# EAGLE design PowerSensor (EAGLE 8.2.1)
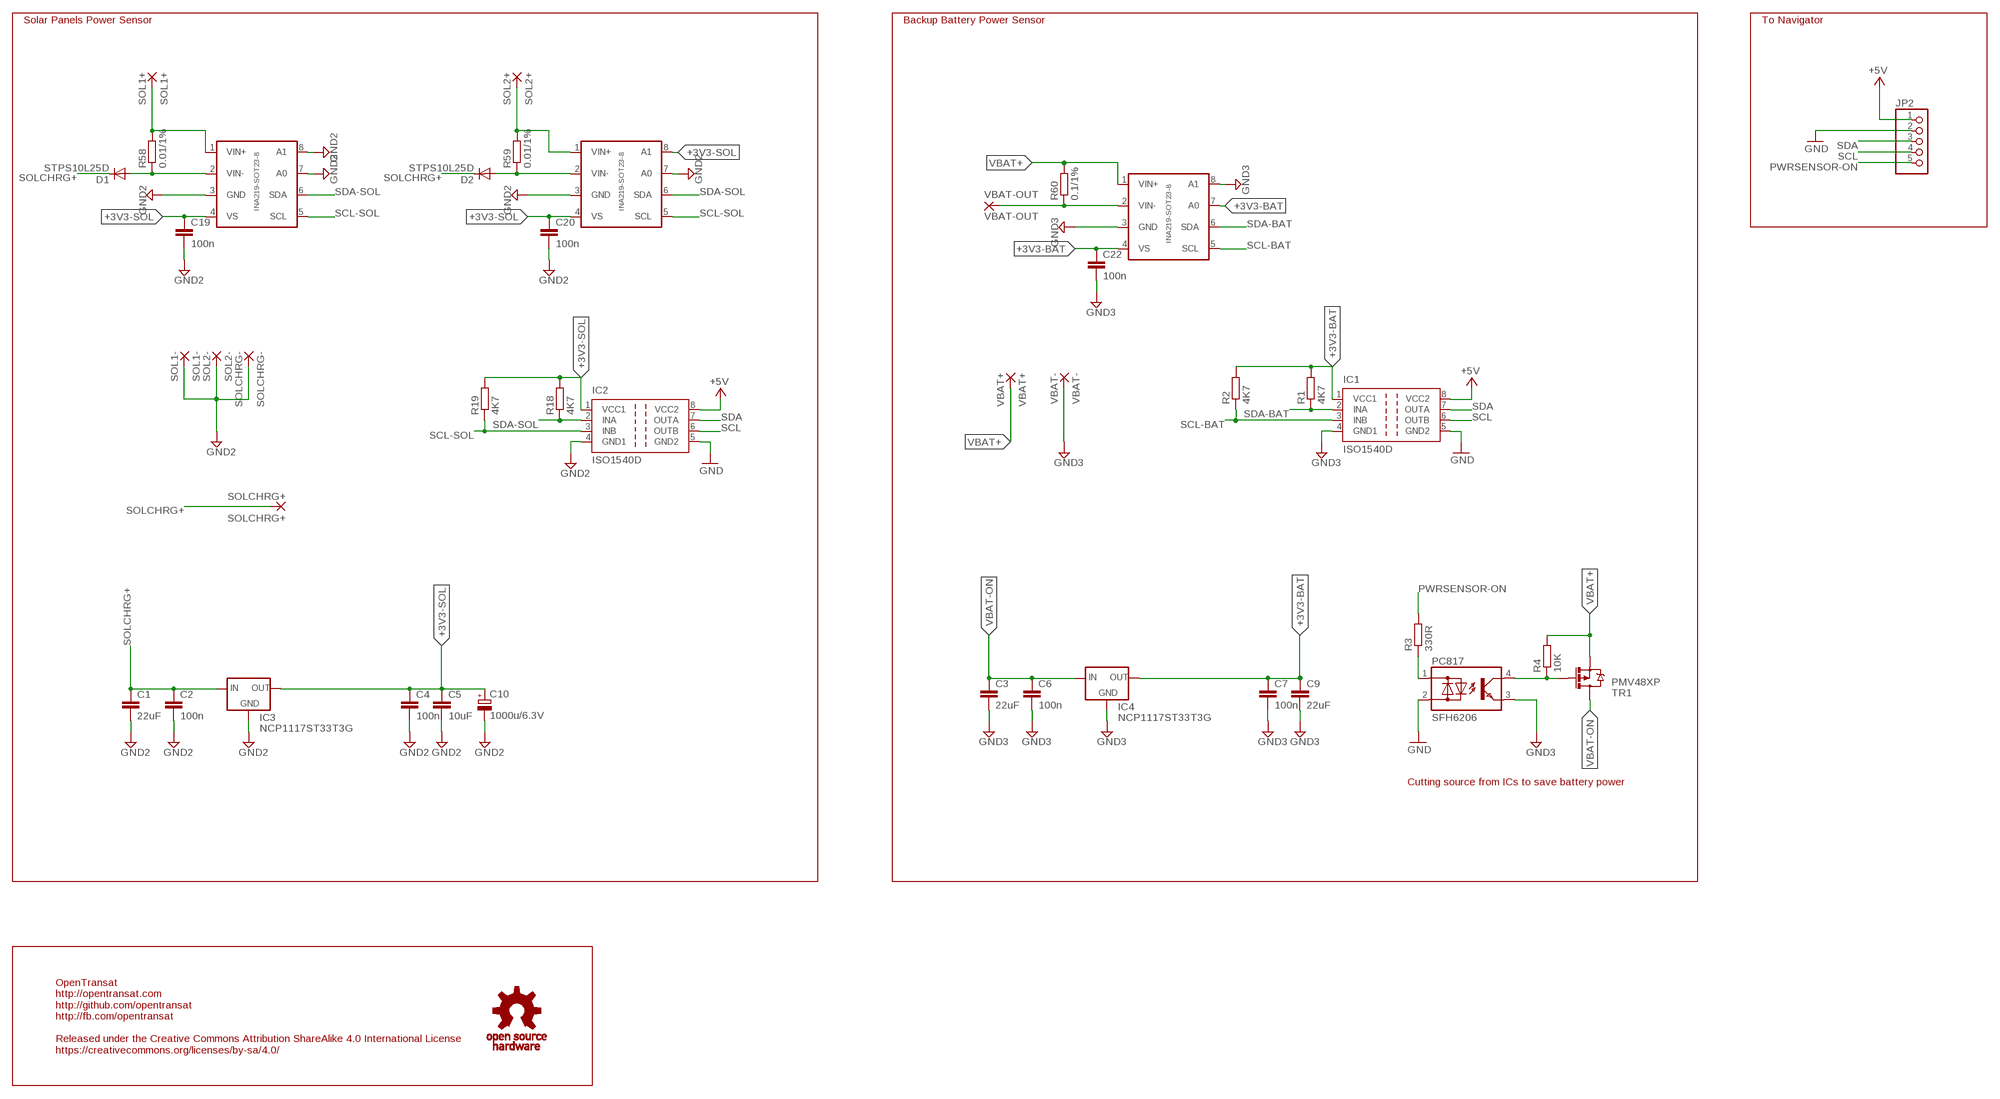
[diagram p0: schematic, sheet 1]

## Parts
C1  22uF  C-EUC1210  [C1210]
C2  100n  C-EUC0603  [C0603]
C3  22uF  C-EUC1210  [C1210]
C4  100n  C-EUC0603  [C0603]
C5  10uF  C-EUC1206  [C1206]
C6  100n  C-EUC0603  [C0603]
C7  100n  C-EUC0603  [C0603]
C9  22uF  C-EUC1210  [C1210]
C10  1000u/6.3V  CPOL-EUE3.5-8  [E3,5-8]
C19  100n  C-EUC0603  [C0603]
C20  100n  C-EUC0603  [C0603]
C22  100n  C-EUC0603  [C0603]
D1  STPS10L25D  DIODE-TO220V  [TO220ACS]
D2  STPS10L25D  DIODE-TO220V  [TO220ACS]
IC1  ISO1540D  ISO7220A  [SO-08]
IC2  ISO1540D  ISO7220A  [SO-08]
IC3  NCP1117ST33T3G  LM1117MP-3.3  [SOT223]
IC4  NCP1117ST33T3G  LM1117MP-3.3  [SOT223]
JP2  PINHD-1X5  [1X05]
PC817  SFH6206  [DIL4-SMD]
R1  4K7  R-EU_R0603  [R0603]
R2  4K7  R-EU_R0603  [R0603]
R3  330R  R-EU_R0603  [R0603]
R4  10K  R-EU_R0603  [R0603]
R18  4K7  R-EU_R0603  [R0603]
R19  4K7  R-EU_R0603  [R0603]
R58  0.01/1%  R-EU_R2512  [R2512]
R59  0.01/1%  R-EU_R2512  [R2512]
R60  0.1/1%  R-EU_R2512  [R2512]
SOL1+  SOL1+  SMD10  [SMD5,08-10,16]
SOL1-  SOL1-  SMD10  [SMD5,08-10,16]
SOL2+  SOL2+  SMD10  [SMD5,08-10,16]
SOL2-  SOL2-  SMD10  [SMD5,08-10,16]
SOLCHRG+  SOLCHRG+  SMD10  [SMD5,08-10,16]
SOLCHRG-  SOLCHRG-  SMD10  [SMD5,08-10,16]
TR1  PMV48XP  MOSFET-PCHANNEL_SOT23-3  [SOT23-3]
U$1  INA219-SOT23-8  [SOT23-8]
U$2  OSHW  [OSHWM]
U$4  INA219-SOT23-8  [SOT23-8]
U$5  INA219-SOT23-8  [SOT23-8]
VBAT+  VBAT+  WIREPADSMD2,54-5,08  [SMD2,54-5,08]
VBAT-  VBAT-  WIREPADSMD2,54-5,08  [SMD2,54-5,08]
VBAT-OUT  VBAT-OUT  WIREPADSMD2,54-5,08  [SMD2,54-5,08]

## Nets
+3V3-BAT: C7.1 C9.1 C22.1 IC1.1(VCC1) IC4.2(OUT) IC4.4(OUT) R1.2 R2.2 U$5.4(VS) U$5.7(A0)
+3V3-SOL: C4.1 C5.1 C10.+ C19.1 C20.1 IC2.1(VCC1) IC3.2(OUT) IC3.4(OUT) R18.2 R19.2 U$1.4(VS) U$4.4(VS) U$4.8(A1)
+5V: IC1.8(VCC2) IC2.8(VCC2) JP2.1
GND: IC1.5(GND2) IC2.5(GND2) JP2.2 PC817.2(AC2)
GND2: C1.2 C2.2 C4.2 C5.2 C10.- C19.2 C20.2 IC2.4(GND1) IC3.1(GND) SOL1-.1(P) SOL2-.1(P) SOLCHRG-.1(P) U$1.3(GND) U$1.7(A0) U$1.8(A1) U$4.3(GND) U$4.7(A0)
GND3: C3.2 C6.2 C7.2 C9.2 C22.2 IC1.4(GND1) IC4.1(GND) PC817.3(E) U$5.3(GND) U$5.8(A1) VBAT-.1(P)
N$1: D1.A R58.1 U$1.2(VIN-)
N$2: D2.A R59.1 U$4.2(VIN-)
N$3: R58.2 SOL1+.1(P) U$1.1(VIN+)
N$4: R59.2 SOL2+.1(P) U$4.1(VIN+)
N$6: R60.1 U$5.2(VIN-) VBAT-OUT.1(P)
N$7: PC817.1(AC1) R3.1
N$8: PC817.4(C) R4.1 TR1.1(G)
PWRSENSOR-ON: JP2.5 R3.2
SCL: IC1.6(OUTB) IC2.6(OUTB) JP2.4
SCL-BAT: IC1.3(INB) R2.1 U$5.5(SCL)
SCL-SOL: IC2.3(INB) R19.1 U$1.5(SCL) U$4.5(SCL)
SDA: IC1.7(OUTA) IC2.7(OUTA) JP2.3
SDA-BAT: IC1.2(INA) R1.1 U$5.6(SDA)
SDA-SOL: IC2.2(INA) R18.1 U$1.6(SDA) U$4.6(SDA)
SOLCHRG+: C1.1 C2.1 D1.C D2.C IC3.3(IN) SOLCHRG+.1(P)
VBAT+: R4.2 R60.2 TR1.2(S) U$5.1(VIN+) VBAT+.1(P)
VBAT-ON: C3.1 C6.1 IC4.3(IN) TR1.3(D)

## Notes on the sheet
- Solar Panels Power Sensor | Backup Battery Power Sensor | To Navigator
- Cutting source from ICs to save battery power
- OpenTransat
  http://opentransat.com
  http://github.com/opentransat
  http://fb.com/opentransat
  
  Released under the Creative Commons Attribution ShareAlike 4.0 International License
  https://creativecommons.org/licenses/by-sa/4.0/

## Library data of the parts
C1-C7 C9 C19 C20 C22 = rcl:C-EU: CAPACITOR, European symbol
C10 = rcl:CPOL-EU: POLARIZED CAPACITOR, European symbol
D1 D2 = diode:DIODE-: DIODE
IC1 IC2 = texas:ISO7220: DUAL DIGITAL ISOLATORS Source: http://focus.ti.com/lit/ds/symlink/iso7221a.pdf; MPN: ISO7220AD; OC_FARNELL: 1390649; OC_NEWARK: 48M0666
IC3 IC4 = lm1117_10:LM1117?-*: 800mA Low-Dropout Linear Regulator Source: http://www.ti.com/lit/ds/symlink/lm1117-n.pdf; MF: Texas Instruments; MPN: LM1117MP-3.3; OC_FARNELL: 9778195; OC_NEWARK: 28X3416
JP2 = pinhead:PINHD-1X5: PIN HEADER
PC817 = optocoupler:SFH620: Optocoupler, Phototransistor Output, AC Input Source: http://www.vishay.com/docs/83675/sfh620.pdf; MF: VISHAY/TELEFUNKEN; MPN: SFH6206-3; OC_FARNELL: 1469585; OC_NEWARK: 58K2214
R1-R4 R18 R19 R58-R60 = rcl:R-EU_: RESISTOR, European symbol
SOL1+ SOL1- SOL2+ SOL2- SOLCHRG+ SOLCHRG- = wirepad:SMD10: SMD PAD
TR1 = Simplex-DiscreteSemi:MOSFET-PCHANNEL: Generic P-channel mosfet
U$1 U$4 U$5 = INA219:INA219-SOT23-8: INA219 Bi-Directional CURRENT/POWER MONITOR with I2C™ Interface http://www.ti.com/lit/ds/symlink/ina219.pdf
U$2 = oshw:OSHW
VBAT+ VBAT- VBAT-OUT = wirepad:WIREPAD: Wire PAD connect wire on PCB

## Net classes
3 GND: width 0.305 mm, drill 0.508 mm, clearance 0.203 mm

## Board
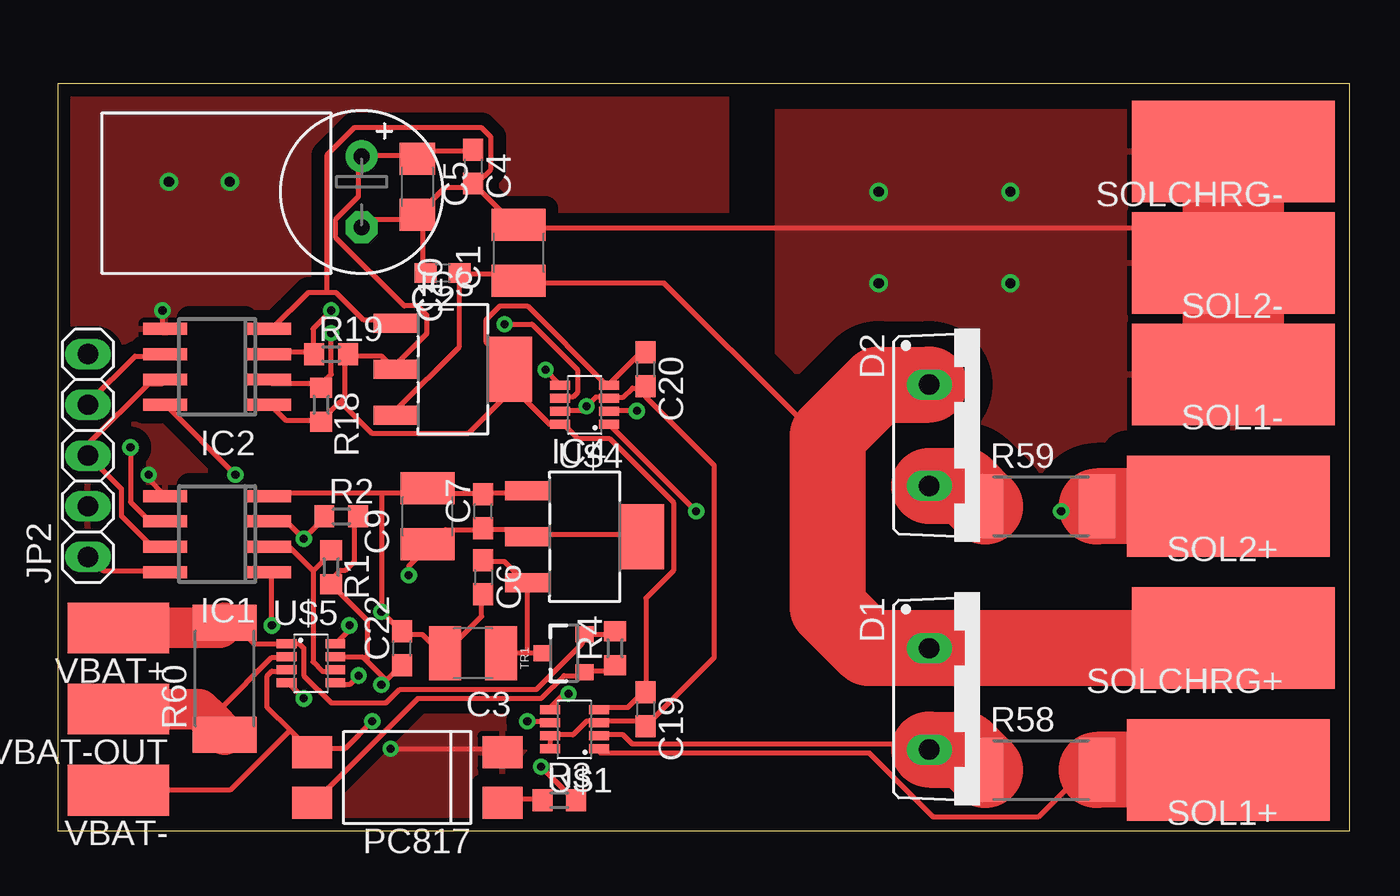
[diagram p1: board, top side]
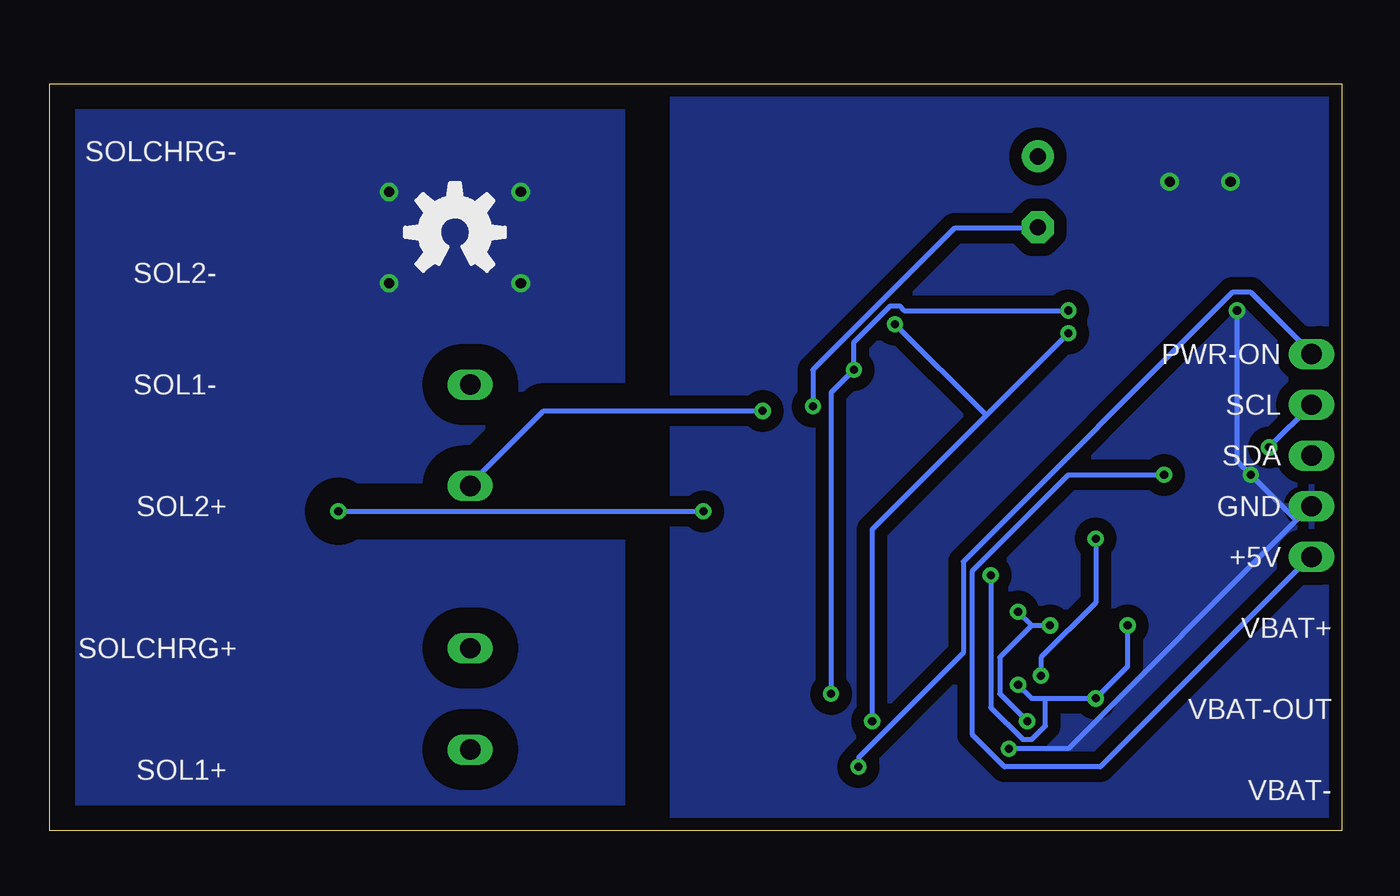
[diagram p2: board, bottom side, seen from below]

Size 64.75 x 37.43 mm. Coordinates in mm from the lower left corner, seen from the top.
Outline: 0,0 64.75,0 64.75,37.43 0,37.43 0,0
Copper layers (1*16): Top 0.035mm / dielectric 0.5mm / Bottom 0.035mm
Design rules "autorouter *": minimum track width 10mil, minimum drill 16mil, track to track 8mil, track to pad 8mil, pad to pad 8mil, via to via 8mil, smd to smd 8mil, copper to edge 15mil, drill to drill 12mil, minimum pad ring 10mil, minimum via ring 8mil, stop-mask expansion 1mil, vias tented up to drill 30mil, thermal gap 10mil

### Footprints (pad centres in the part's own frame; a part is rotated, then mirrored left to right if it is on the bottom)
C1210 = smd 1.6 x 2.7: 1 -1.4,0; 2 1.4,0
C0603 = smd 1.1 x 1: 1 -0.85,0; 2 0.85,0
C1206 = smd 1.6 x 1.8: 1 -1.4,0; 2 1.4,0
E3,5-8 = drill 0.813 pad 1.6: + -1.778,0 | drill 0.813 pad 1.6 octagon: - 1.778,0
TO220ACS = drill 1.016 long: A 2.54,-2.54; C -2.54,-2.54
SO-08 = smd 0.6 x 2.2: 1 -1.905,-2.6; 2 -0.635,-2.6; 3 0.635,-2.6; 4 1.905,-2.6; 5 1.905,2.6; 6 0.635,2.6; 7 -0.635,2.6; 8 -1.905,2.6
SOT223 = smd 0.95 x 2.15: 1 -2.3,-2.9; 2 0,-2.9; 3 2.3,-2.9 | smd 3.25 x 2.15: 4 0,2.9
1X05 = drill 1.016 long: 1 -5.08,0; 2 -2.54,0; 3 0,0; 4 2.54,0; 5 5.08,0
DIL4-SMD = smd 1.6 x 2: 1 -1.27,-4.77; 2 1.27,-4.77; 3 1.27,4.77; 4 -1.27,4.77
R0603 = smd 1 x 1.1: 1 -0.85,0; 2 0.85,0
R2512 = smd 1.8 x 3.2: 1 -2.8,0; 2 2.8,0
SMD5,08-10,16 = smd 5.08 x 10.16: 1 0,0
SOT23-3 = smd 0.8 x 0.9: 1 -0.95,-1; 2 0.95,-1; 3 0,1.1
SOT23-8 = smd 1 x 0.45: 1 -1.225,0.975; 2 -1.225,0.325; 3 -1.225,-0.325; 4 -1.225,-0.975; 5 1.225,-0.975; 6 1.225,-0.325; 7 1.225,0.325; 8 1.225,0.975
SMD2,54-5,08 = smd 2.54 x 5.08: 1 0,0

### Placement (x,y rotation side)
C1  23.11,28.96 90 top
C2  19.3,27.94 180 top
C3  20.83,8.89 180 top
C4  20.83,33.27 270 top
C5  18.03,32.26 270 top
C6  21.34,12.7 270 top
C7  21.34,16 90 top
C9  18.54,15.75 90 top
C10  15.24,32 270 top
C19  29.46,6.1 270 top
C20  29.46,23.11 270 top
C22  17.27,9.14 90 top
D1  46.23,6.6 270 top
D2  46.23,19.81 270 top
IC1  8,14.86 90 top
IC2  8,23.24 90 top
IC3  19.81,23.11 270 top
IC4  26.42,14.73 270 top
JP2  1.52,18.8 90 top
PC817  17.53,2.67 90 top
R1  13.72,13.21 270 top
R2  14.22,15.75 0 top
R3  25.15,1.52 0 top
R4  27.94,9.14 90 top
R18  13.21,21.34 270 top
R19  13.72,23.88 0 top
R58  49.28,3.05 0 top
R59  49.28,16.26 0 top
R60  8.38,7.62 90 top
SOL1+  58.67,3.05 90 top
SOL1-  58.93,22.86 90 top
SOL2+  58.67,16.26 90 top
SOL2-  58.93,28.45 90 top
SOLCHRG+  58.93,9.65 90 top
SOLCHRG-  58.93,34.04 90 top
TR1  25.4,8.89 90 top
U$1  25.91,5.08 180 top
U$2  44.45,29.97 0 top
U$4  26.42,21.34 180 top
U$5  12.7,8.38 0 top
VBAT+  3.05,10.16 90 top
VBAT-  3.05,2.03 90 top
VBAT-OUT  3.05,6.1 90 top

### Tracks (layer width: path | path; a pad name or v marks a point on that pad's centre or on a via)
+3V3-BAT  (via drill 0.41)
  Top 0.254: R2.2 14.86,15.54 14.86,13.49 14.4,13.03 14.17,13.03 13.72,12.57 R1.2 13.72,12.34 15.54,10.52 15.54,8.46 | v12.34,6.63 11.66,7.32 U$5.4 | 16.46,7.54 17.14,8.23 C22.1 | 16.46,7.54 15.54,8.46 | 15.54,8.46 15.32,8.69 13.95,8.69 U$5.7 | 16.46,7.54 v16.23,7.32 | v10.74,10.29 10.74,12.8 IC1.1 | IC4.4 29.26,14.86 23.55,14.86 IC4.2 23.32,14.86 23.09,15.09 21.49,15.09 C7.1 21.26,15.09 19.43,15.09 18.75,14.4 C9.1 18.52,14.17 17.6,13.26 v17.6,12.8
  Bottom 0.254: 14.86,6.63 15.54,6.63 v16.23,7.32 | 14.86,6.63 v12.34,6.63 10.74,8.23 v10.74,10.29 | 14.86,6.63 14.86,5.26 15.54,4.57 16,4.57 17.6,6.17 v17.6,12.8
+3V3-SOL
  Top 0.254: C4.1 20.8,34.06 18.29,34.06 18.06,33.83 C5.1 17.83,33.83 15.32,33.83 C10.+ 15.09,33.6 15.09,31.77 13.95,30.63 13.95,29.72 17.37,26.29 18.06,26.29 18.52,25.83 18.52,24.92 16.92,23.32 IC3.2 16.69,23.32 16.23,23.77 14.63,23.77 R19.2 14.4,23.77 14.4,21.72 14.17,21.49 | IC2.1 10.74,21.26 11.43,20.57 13.03,20.57 R18.2 13.26,20.57 14.17,21.49 | C20.1 29.26,24 27.66,22.4 U$4.4 27.43,22.4 23.55,26.29 22.17,26.29 21.49,25.6 21.49,24.46 22.63,23.32 IC3.4 | U$1.4 27.2,6.17 28.57,6.17 29.26,6.86 C19.1 29.49,7.09 29.49,11.66 30.86,13.03 30.86,16.46 27.66,19.66 26.06,19.66 25.38,20.34 U$4.8 25.15,20.34 24.69,20.34 22.86,22.17 | 22.86,22.17 22.86,23.09 IC3.4 | 14.17,21.49 15.77,19.89 20.57,19.89 22.86,22.17 | 22.86,22.17 IC3.4
+5V  (via drill 0.41)
  Top 0.254: IC1.8 5.26,13.03 2.29,13.03 1.6,13.72 JP2.1 | v8.91,17.83 5.49,21.26 IC2.8
  Bottom 0.254: v8.91,17.83 13.72,17.83 18.52,13.03 18.52,4.8 16.92,3.2 12.12,3.2 1.6,13.72 JP2.1
GND  (via drill 0.41, 0.51)
  Top 0.254: v16.69,4.12 22.17,4.12 PC817.2 | v4.57,17.83 4.57,17.6 5.26,16.92 IC1.5 | v5.26,26.06 5.26,25.15 IC2.5
  Bottom 0.254: v16.69,4.12 13.72,4.12 2.29,15.54 | 2.29,15.54 1.6,16.23 JP2.2 | 2.29,15.54 v4.57,17.83 5.26,18.52 v5.26,26.06
  other vias: 5.59,32.51 8.64,32.51
  pour Bottom (isolate 0.635): -0.51,-2.03 33.53,-2.03 33.53,39.12 0,39.12
  pour Top (isolate 0.635): -2.54,-4.57 33.53,-4.57 33.53,42.16 -2.03,42.16
GND2  (via drill 0.41, 0.51)
  Top 0.254: U$4.7 25.38,21.03 26.29,21.03 v26.52,21.26 26.98,21.72 27.43,21.72 U$4.3 27.66,21.72 28.35,21.72 28.8,22.17 29.26,22.17 C20.2 29.49,22.17 29.49,21.72 32.92,18.29 32.92,8.69 29.49,5.26 C19.2 29.26,5.26 29.03,5.49 27.2,5.49 U$1.3 26.98,5.49 26.52,5.49 25.83,4.8 24.69,4.8 U$1.7 24.69,4.57 U$1.8 | 13.49,26.98 12.57,26.98 10.74,25.15 IC2.4 | 13.49,26.98 13.95,26.98 15.32,25.6 16.69,25.6 IC3.1 | C4.2 21.03,32.23 23.09,30.18 C1.2 23.32,30.18 57.15,30.18 | C2.2 18.29,28.12 18.29,30.4 18.06,30.63 C5.2 | C5.2 17.83,30.63 15.54,30.63 15.32,30.4 C10.- | C4.2 20.8,32.23 19.43,32.23 18.06,30.86 C5.2 | 13.49,26.98 13.49,33.83 14.86,35.2 21.26,35.2 21.72,34.75 21.72,33.15 21.03,32.46 C4.2 | 57.15,30.18 58.75,28.57 SOL2-.1 | SOL1-.1 58.98,22.86 | 58.98,28.35 SOL2-.1 | 58.75,33.83 SOLCHRG-.1 | 57.15,30.18 SOL2-.1
  Top 5.08: SOLCHRG-.1 58.93,28.4 58.98,28.35 | SOL2-.1 SOL1-.1
  Bottom 0.254: v26.52,21.26 26.52,23.09 19.43,30.18 15.32,30.18 C10.-
  other vias: 41.15,32 47.75,32 41.15,27.43 47.75,27.43
  pour Bottom (isolate 1.27): 36.07,-2.03 69.6,-2.03 69.6,39.12 36.07,39.12
  pour Top (isolate 1.27): 36.07,-4.57 71.63,-4.57 71.63,42.16 36.07,42.16
GND3  (via drill 0.41)
  Top 0.254: 11.66,5.03 12.57,4.12 PC817.3 12.8,4.12 14.4,4.12 v15.77,5.49 | 11.66,5.03 10.52,6.17 10.52,7.77 10.74,8 11.43,8 U$5.3 | 11.66,5.03 8.69,2.06 3.2,2.06 VBAT-.1 | v14.63,10.29 14.63,10.06 13.95,9.37 U$5.8 | C6.2 21.26,11.66 21.26,10.74 19.43,8.91 C3.2 19.2,8.91 18.29,9.83 17.37,9.83 C22.2 17.14,10.06 v16.23,10.97 16.23,16.92 | IC4.1 23.32,16.92 21.49,16.92 C7.2 21.26,16.92 18.97,16.92 18.75,17.14 C9.2 18.52,17.14 18.29,16.92 16.23,16.92 | 16.23,16.92 10.74,16.92 IC1.4
  Bottom 0.254: 15.54,10.29 v14.63,10.29 | v16.23,10.97 15.54,10.29 | v15.77,5.49 17.14,6.86 17.14,8.69 15.54,10.29
N$1
  Top 0.254: U$1.2 27.2,4.8 28.35,4.8 28.8,4.34 41.83,4.34 D1.A
  Top 3.81: D1.A 45.46,4.06 R58.1
N$2  (via drill 0.41)
  Top 0.254: v29.03,21.03 27.66,21.03 U$4.2
  Top 3.81: D2.A 45.46,17.27 R59.1
  Bottom 0.254: v29.03,21.03 40.01,21.03 43.66,17.37 D2.A
N$3
  Top 0.254: U$1.1 27.2,3.89 40.69,3.89 43.89,0.69 49.15,0.69 50.52,2.06 R58.2
  Top 3.81: SOL1+.1 R58.2
N$4  (via drill 0.41)
  Top 0.254: v32,16 27.66,20.34 U$4.1 | v50.29,16 R59.2
  Top 3.81: SOL2+.1 R59.2
  Bottom 0.254: v50.29,16 v32,16
N$6
  Top 0.254: U$5.2 11.43,8.69 10.74,8.69 8.23,6.17 7.61,5.59
  Top 2.032: R60.1 7.61,5.59 7.11,6.1 VBAT-OUT.1
N$7
  Top 0.254: R3.1 24.23,1.6 22.4,1.6 PC817.1
N$8
  Top 0.254: R4.1 27.89,8.23 27.66,8 26.52,8 TR1.1 26.29,7.77 25.38,7.77 24.23,6.63 18.06,6.63 12.8,1.37 PC817.4
PWRSENSOR-ON  (via drill 0.41)
  Top 0.254: v24.23,3.2 25.83,1.6 R3.2
  Bottom 0.254: v24.23,3.2 24.23,3.66 18.97,8.91 18.97,13.49 5.49,26.98 4.57,26.98 1.6,24 JP2.5
SCL  (via drill 0.41)
  Top 0.254: v3.66,19.2 3.66,16.46 4.57,15.54 5.26,15.54 IC1.6 | IC2.6 5.26,23.77 3.89,23.77 1.6,21.49 JP2.4
  Bottom 0.254: JP2.4 v3.66,19.2
SCL-BAT  (via drill 0.41)
  Top 0.254: v15.09,7.77 14.63,7.32 13.95,7.32 U$5.5 | R2.1 13.26,15.54 v12.34,14.63 11.66,15.32 10.74,15.32 IC1.3
  Bottom 0.254: v15.09,7.77 15.09,8.69 12.34,11.43 v12.34,14.63
SCL-SOL  (via drill 0.41)
  Top 0.254: 12.8,24 10.74,24 IC2.3 | v25.6,6.86 25.38,6.86 24.69,6.17 U$1.5 | v24.46,23.09 25.15,22.4 U$4.5 | 12.8,24 12.8,25.15 v13.72,26.06 | 12.8,24 R19.1
  Bottom 0.254: v25.6,6.86 25.6,21.95 v24.46,23.09 24.46,24.46 22.63,26.29 22.17,26.29 21.95,26.06 v13.72,26.06
SDA
  Top 0.254: IC1.7 5.26,14.4 4.57,14.4 3.2,15.77 3.2,17.14 1.6,18.75 JP2.3 1.6,18.97 1.6,19.43 4.57,22.4 5.26,22.4 IC2.7
SDA-BAT
  Top 0.254: 12.8,13.03 12.8,8.46 13.26,8 13.72,8 U$5.6 | 12.8,13.03 13.72,13.95 R1.1 | 12.8,13.03 11.66,14.17 10.74,14.17 IC1.2
SDA-SOL  (via drill 0.41)
  Top 0.254: v23.55,5.49 24.46,5.49 U$1.6 | v13.72,24.92 13.72,22.86 13.26,22.4 R18.1 13.03,22.4 10.74,22.4 IC2.2 | v22.4,25.38 23.77,25.38 26.06,23.09 26.06,21.95 25.83,21.72 25.38,21.72 U$4.6
  Bottom 0.254: v23.55,5.49 23.55,15.09 17.83,20.8 | v13.72,24.92 17.83,20.8 | 17.83,20.8 v22.4,25.38
SOLCHRG+
  Top 0.254: IC3.3 16.92,21.03 20.12,24.23 20.12,27.89 C2.1 20.34,27.89 22.86,27.89 23.09,27.66 C1.1 23.32,27.43 30.4,27.43 37.03,20.8 38.61,19.81
  Top 3.81: SOLCHRG+.1 58.42,9.14 D1.C 40.64,9.14 38.61,11.18 38.61,19.81 41.15,22.35 D2.C
VBAT+
  Top 0.254: R4.2 27.89,9.83 26.52,9.83 TR1.2 26.29,9.83 26.29,9.37 24,7.09 17.14,7.09 16.46,6.4 13.72,6.4 12.34,7.77 12.34,9.14 12.12,9.37 11.66,9.37 U$5.1 11.43,9.37 9.83,9.37 9.14,10.06 R60.2
  Top 2.032: VBAT+.1 8.12,10.16 R60.2
VBAT-ON
  Top 0.254: C6.1 21.49,13.49 22.4,13.49 23.32,12.57 IC4.3 23.55,12.34 23.55,8.91 | 23.55,8.91 22.4,8.91 C3.1 | 23.55,8.91 24.23,8.91 TR1.3

### Text on the board
_bsilk: SOLCHRG- | SOL2- | PWR-ON | SOL1- | SCL | SDA | GND | SOL2+ | +5V | VBAT+ | SOLCHRG+ | VBAT-OUT | SOL1+ | VBAT-